# EAGLE schematic ESQUEMATICO (EAGLE 9.7.0)
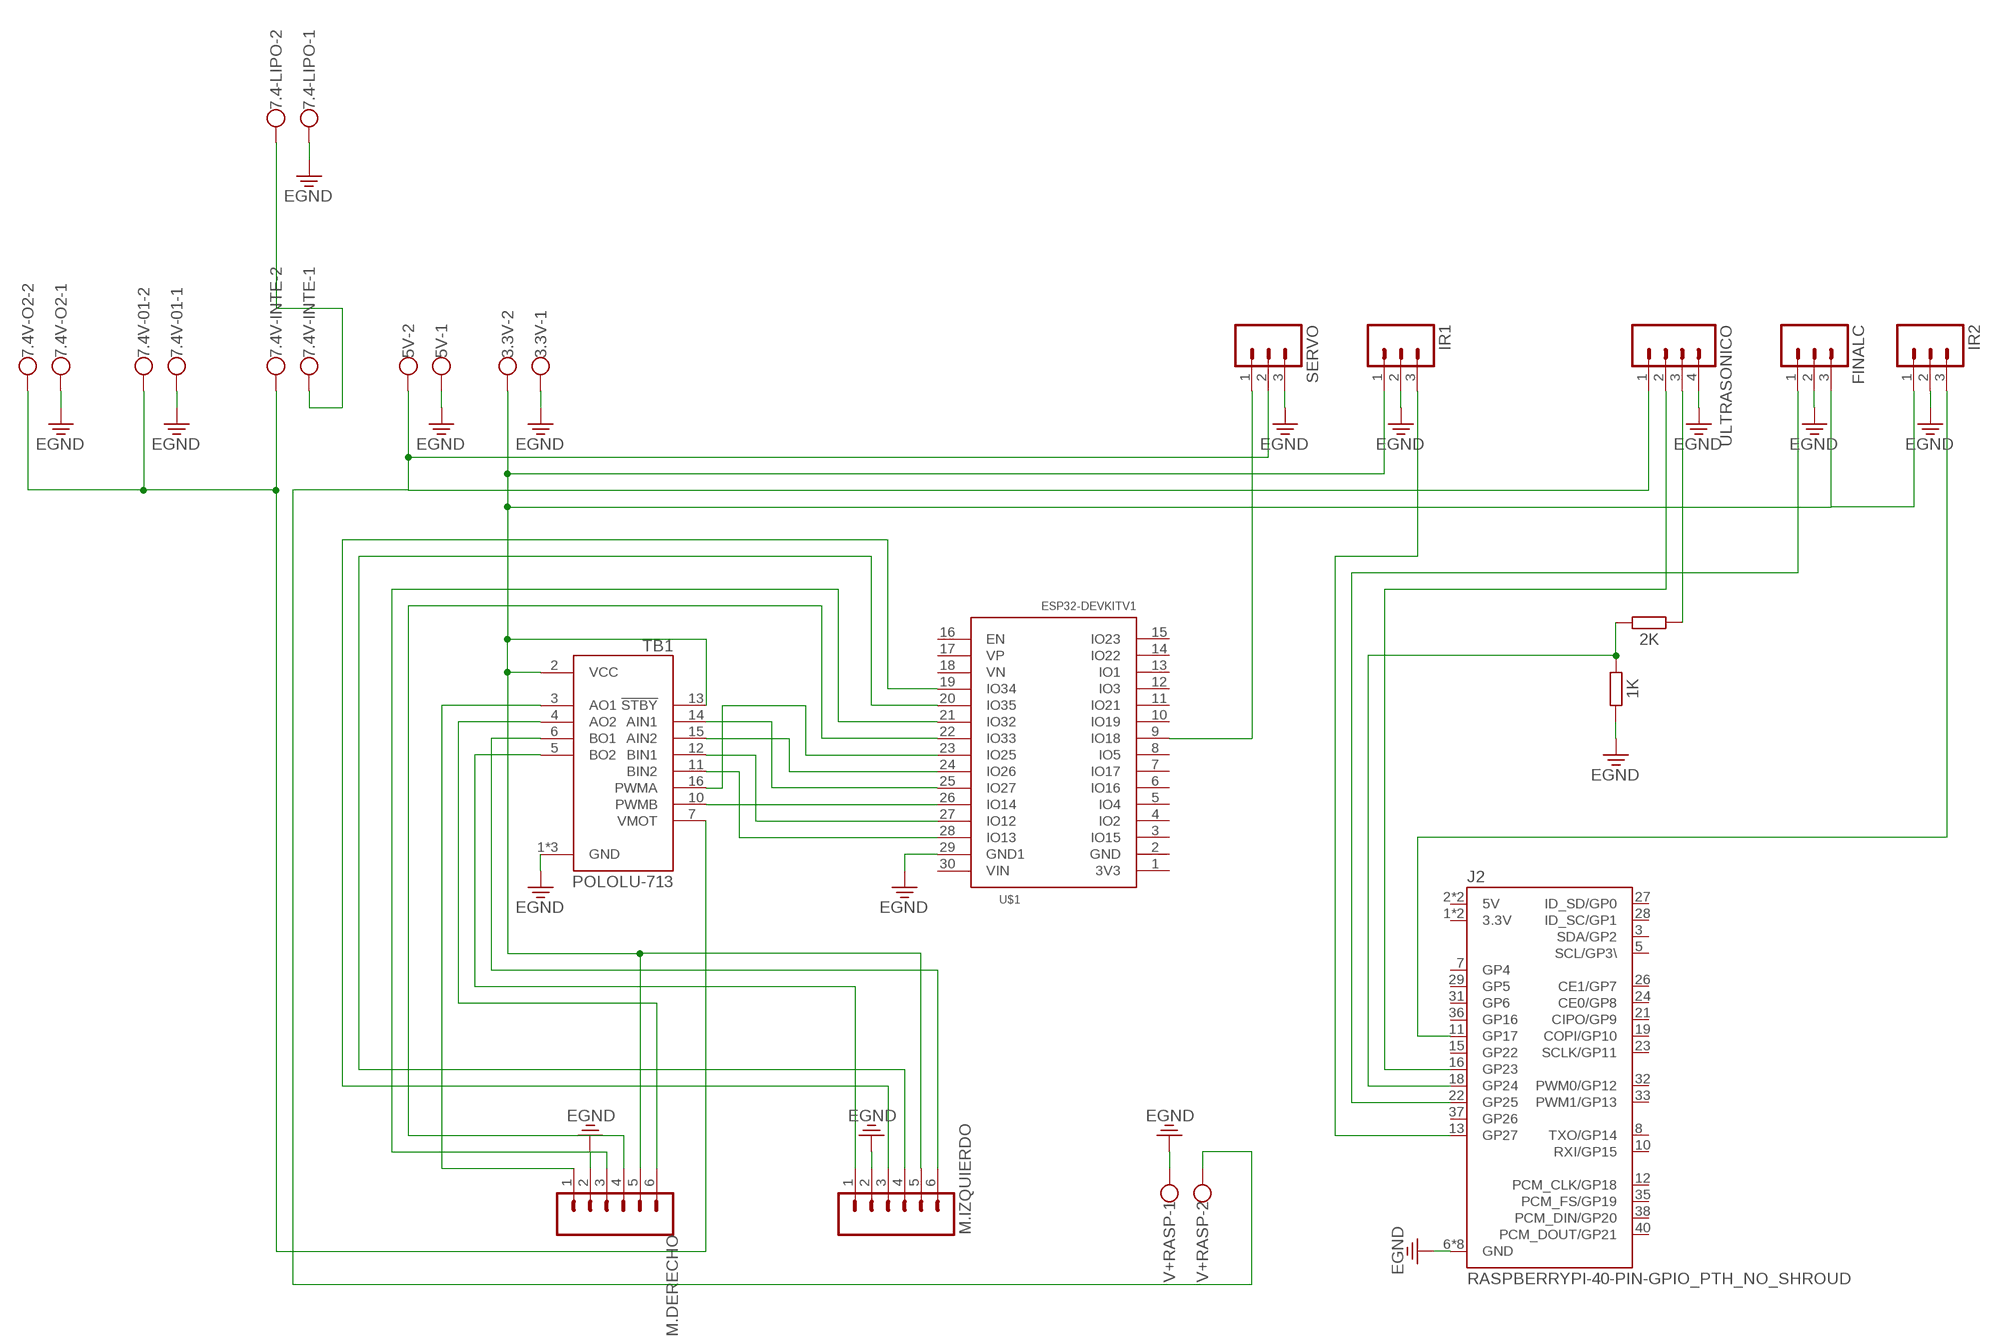
[diagram p0: schematic, sheet 1]

## Parts
1K  R_AXIAL-11.7MM-PITCH  [RESAD1176W63L850D250B]
2K  R_AXIAL-11.7MM-PITCH  [RESAD1176W63L850D250B]
3.3V  W237-102  [W237-102]
5V  W237-102  [W237-102]
7.4-LIPO  W237-102  [W237-102]
7.4V-01  W237-102  [W237-102]
7.4V-INTE  W237-102  [W237-102]
7.4V-O2  W237-102  [W237-102]
FINALC  MA03  [03P]
IR1  MA03  [03P]
IR2  MA03  [03P]
J2  RASPBERRYPI-40-PIN-GPIO_PTH_NO_SHROUD  [2X20]
M.DERECHO  MA06  [06PA]
M.IZQUIERDO  MA06  [06PA]
SERVO  MA03  [03P]
TB1  POLOLU-713  [SHIELD_POLOLU-713]
U$1  ESP32DEVKITV1  [ESP32-DEVKITV1]
ULTRASONICO  MA04  [04PA]
V+RASP  W237-102  [W237-102]

## Nets
3.3V: 3.3V.2 FINALC.3 IR1.1 IR2.1 M.DERECHO.5 M.IZQUIERDO.5 TB1.2(VCC) TB1.13(!STBY)
5V: 5V.2 SERVO.2 ULTRASONICO.1 V+RASP.2
7.4V: 7.4-LIPO.2 7.4V-INTE.1
EGND: 1K.2 3.3V.1 5V.1 7.4-LIPO.1 7.4V-01.1 7.4V-O2.1 FINALC.2 IR1.2 IR2.2 J2.6(GND) J2.9(GND) J2.14(GND) J2.20(GND) J2.25(GND) J2.30(GND) J2.34(GND) J2.39(GND) M.DERECHO.2 M.IZQUIERDO.2 SERVO.3 TB1.1(GND) TB1.8(GND) TB1.9(GND) U$1.29(GND1) ULTRASONICO.4 V+RASP.1
M.DERECHO2: 7.4V-01.2 7.4V-INTE.2 7.4V-O2.2 TB1.7(VMOT)
N$2: TB1.16(PWMA) U$1.23(IO25)
N$3: TB1.10(PWMB) U$1.26(IO14)
N$4: TB1.11(BIN2) U$1.28(IO13)
N$5: TB1.12(BIN1) U$1.27(IO12)
N$6: TB1.15(AIN2) U$1.24(IO26)
N$8: TB1.14(AIN1) U$1.25(IO27)
N$9: M.DERECHO.1 TB1.3(AO1)
N$10: M.DERECHO.6 TB1.4(AO2)
N$11: M.IZQUIERDO.6 TB1.6(BO1)
N$12: M.IZQUIERDO.1 TB1.5(BO2)
N$13: M.DERECHO.3 U$1.21(IO32)
N$14: M.DERECHO.4 U$1.22(IO33)
N$15: M.IZQUIERDO.3 U$1.19(IO34)
N$16: M.IZQUIERDO.4 U$1.20(IO35)
N$17: SERVO.1 U$1.9(IO18)
N$19: IR2.3 J2.11(GP17)
N$20: IR1.3 J2.13(GP27)
N$21: J2.16(GP23) ULTRASONICO.2
N$22: FINALC.1 J2.22(GP25)
N$23: 1K.1 2K.2 J2.18(GP24)
N$24: 2K.1 ULTRASONICO.3
Unconnected: J2.3(SDA/GP2) J2.5(SCL/GP3\) J2.7(GP4) J2.8(TXO/GP14) J2.10(RXI/GP15) J2.12(PCM_CLK/GP18) J2.15(GP22) J2.19(COPI/GP10) J2.21(CIPO/GP9) J2.23(SCLK/GP11) J2.24(CE0/GP8) J2.26(CE1/GP7) J2.27(ID_SD/GP0) J2.28(ID_SC/GP1) J2.29(GP5) J2.31(GP6) J2.32(PWM0/GP12) J2.33(PWM1/GP13) J2.35(PCM_FS/GP19) J2.36(GP16) J2.37(GP26) J2.38(PCM_DIN/GP20) J2.40(PCM_DOUT/GP21) U$1.1(3V3) U$1.2(GND) U$1.3(IO15) U$1.4(IO2) U$1.5(IO4) U$1.6(IO16) U$1.7(IO17) U$1.8(IO5) U$1.10(IO19) U$1.11(IO21) U$1.12(IO3) U$1.13(IO1) U$1.14(IO22) U$1.15(IO23) U$1.16(EN) U$1.17(VP) U$1.18(VN) U$1.30(VIN)

## Power pins joined to a net without a drawn wire
3.3V: J2.1(3.3V) J2.17(3.3V)
5V: J2.2(5V) J2.4(5V)

## Library data of the parts
1K 2K = Resistor:R: Resistor Fixed - Generic; CATEGORY: Resistor; SUB-CATEGORY: Fixed
3.3V 5V 7.4-LIPO 7.4V-01 7.4V-INTE 7.4V-O2 V+RASP = con-wago-500:W237-102: WAGO SCREW CLAMP; MPN: 237-102; OC_FARNELL: unknown; OC_NEWARK: 70K9898
FINALC IR1 IR2 SERVO = con-amp-quick:MA03: AMP QUICK CONNECTOR; OC_FARNELL: unknown; OC_NEWARK: unknown
J2 = SparkFun-Connectors:RASPBERRYPI-40-PIN-GPIO: Raspberry Pi GPIO Header 2x20 pin connector, as found on B, B+, A+ models. Both shrouded PTH and SMT versions available. SparkFun Products: GPIO Shrouded Header <https://www.sparkfun.com/products/13054>- PTH SparkFun Pi Wedge (Preassembled) <https://www.sparkfun.com/products/13717>
M.DERECHO M.IZQUIERDO = con-amp-quick:MA06: AMP QUICK CONNECTOR; OC_FARNELL: unknown; OC_NEWARK: unknown
TB1 = POLOLU-713:POLOLU-713: Check availability <https://pricing.snapeda.com/parts/POLOLU-713/Pololu/view-part?ref=eda>; AVAILABILITY: Not in stock; CHECK_PRICES: https://www.snapeda.com/parts/POLOLU-713/Pololu/view-part/?ref=eda; DESCRIPTION: DC-motor driver; IC: TB6612FNG; 100kHz; 1A; Uin mot: 4.5; MF: Pololu; MP: POLOLU-713; PACKAGE: None; PRICE: None; SNAPEDA_LINK: https://www.snapeda.com/parts/POLOLU-713/Pololu/view-part/?ref=snap
U$1 = BibliotecaESP32:ESP32DEVKITV1
ULTRASONICO = con-amp-quick:MA04: AMP QUICK CONNECTOR; OC_FARNELL: unknown; OC_NEWARK: unknown